# Altium schematic sheet Wiring Diagram.SchDoc
size A4
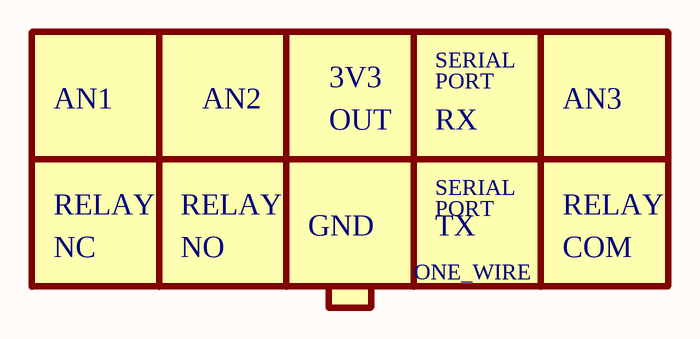
[diagram p0: Wiring Diagram.SchDoc]

## Notes on the sheet
- AN1
- AN2
- 3V3
- SERIAL
- PORT
- AN3
- RELAY
- OUT
- RX
- NC
- NO
- GND
- ONE_WIRE
- TX
- COM